# Altium schematic sheet AUDIO_EAR.SchDoc: EAR OUT
size A4; Author: Silvio Navaretti; CompanyName: Arduino SRL; DrawnBy: Silvio Navaretti; Engineer: Silvio Navaretti; Organization: Arduino SRL; DocumentNumber: ASX00083; SheetNumber: 9; SheetTotal: 11; RevAuthor: Silvio Navaretti
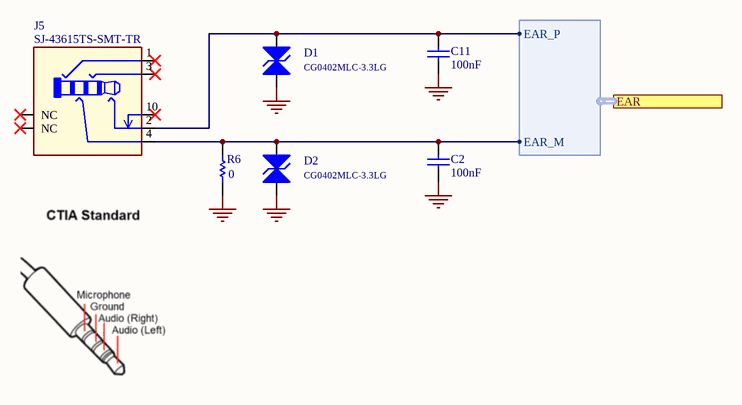
[diagram p0: AUDIO_EAR.SchDoc]

## Parts
C2  value 100nF  [CAP-0402]  (hidden comment: GRM155R61H104KE19D)
C11  value 100nF  [CAP-0402]  (hidden comment: GRM155R61H104KE19D)
D1  CG0402MLC-3.3LG  [0402]
D2  CG0402MLC-3.3LG  [0402]
J5  SJ-43615TS-SMT-TR  [SJ-43615TS-SMT-TR]
R6  value 0  [RES-0402]  (hidden comment: CRCW04020000Z0EDC)

## Ports
EAR (harness EAR)

## Harnesses
EAR: EAR_P, EAR_M

## Nets
GND: C2.1 C11.1 D1.A D2.A R6.1
NetC2_2: C2.2 D2.C J5.4 R6.2 ; port EAR.EAR_M
NetC11_2: C11.2 D1.C J5.2 ; port EAR.EAR_P

Not connected (* = marked no-connect by the designer): J5 1* 3* 10* 11(NC)* 12(NC)*

## Notes on the sheet
- Title:
- ID:
- Date:
- Time:
- Version:
- Sheet
- of
- RevAuthor:
- Reference Designs ARE PROVIDED "AS IS" AND "WITH ALL FAULTS. Arduino SA DISCLAIMS ALL OTHER WARRANTIES, EXPRESS OR IMPLIED, REGARDING PRODUCTS, INCLUDING BUT NOT LIMITED TO, ANY IMPLIED WARRANTIES OF MERCHANTABILITY OR FITNESS FOR A PARTICULAR PURPOSE.
  Arduino SA may make changes to specifications and product descriptions at any time, without notice. The Customer must not rely on the absence or characteristics of any features or instructions marked "reserved" or "undefined". Arduino SA reserves these for future definition and shall have no responsibility whatsoever for conflicts or incompatibilities arising from future changes to them. The product information on the Web Site or Materials is subject to change without notice.
  Do not finalize a design with this info. ARDUINO and other Arduino brands and logos and Trademarks of Arduino SA. All Arduino SA Trademarks cannot be used without owner's formal permission.
- File:
- Author:

## Library data of the parts
C2 C11 = C0015-A.14: CAP CHIP 0402 100nF 10% 50V X5R; Manufacturer: Murata; Code Arduino: A5141; Part Number: GRM155R61H104KE19D; Dielectric: X5R; Tolerance: 10%; Technology: Ceramic; Voltage: 50V; Case Code (Imperial): 0402
D1 D2 = D0073-A.3: DIODE TVS SMD 0402 3.3V ESD PROTECTION; Manufacturer: Bourns; Code Arduino: D0073; Direction: Bidirectional; Part Number: CG0402MLC-3.3LG; Device Type: ESD protection; Datasheet: https://www.mouser.it/datasheet/2/54/MLC-777442.pdf
J5 = J0533-A.9: CONN Audio Jack 3.5mm, 4 conductor, tip switch, SMD mid mount; Manufacturer: Same Sky; Code Arduino: J0533; Part Number: SJ-43615TS-SMT-TR
R6 = R0000-A.24: RES CHIP 0402 0R 1/16W; Manufacturer: Vishay; Code Arduino: 0039; Power: 62.5mW; Tolerance: 0%; Temperature coefficient: 0ppm; Part Number: CRCW04020000Z0EDC; Technology: Thick film; Case Code (Imperial): 0402